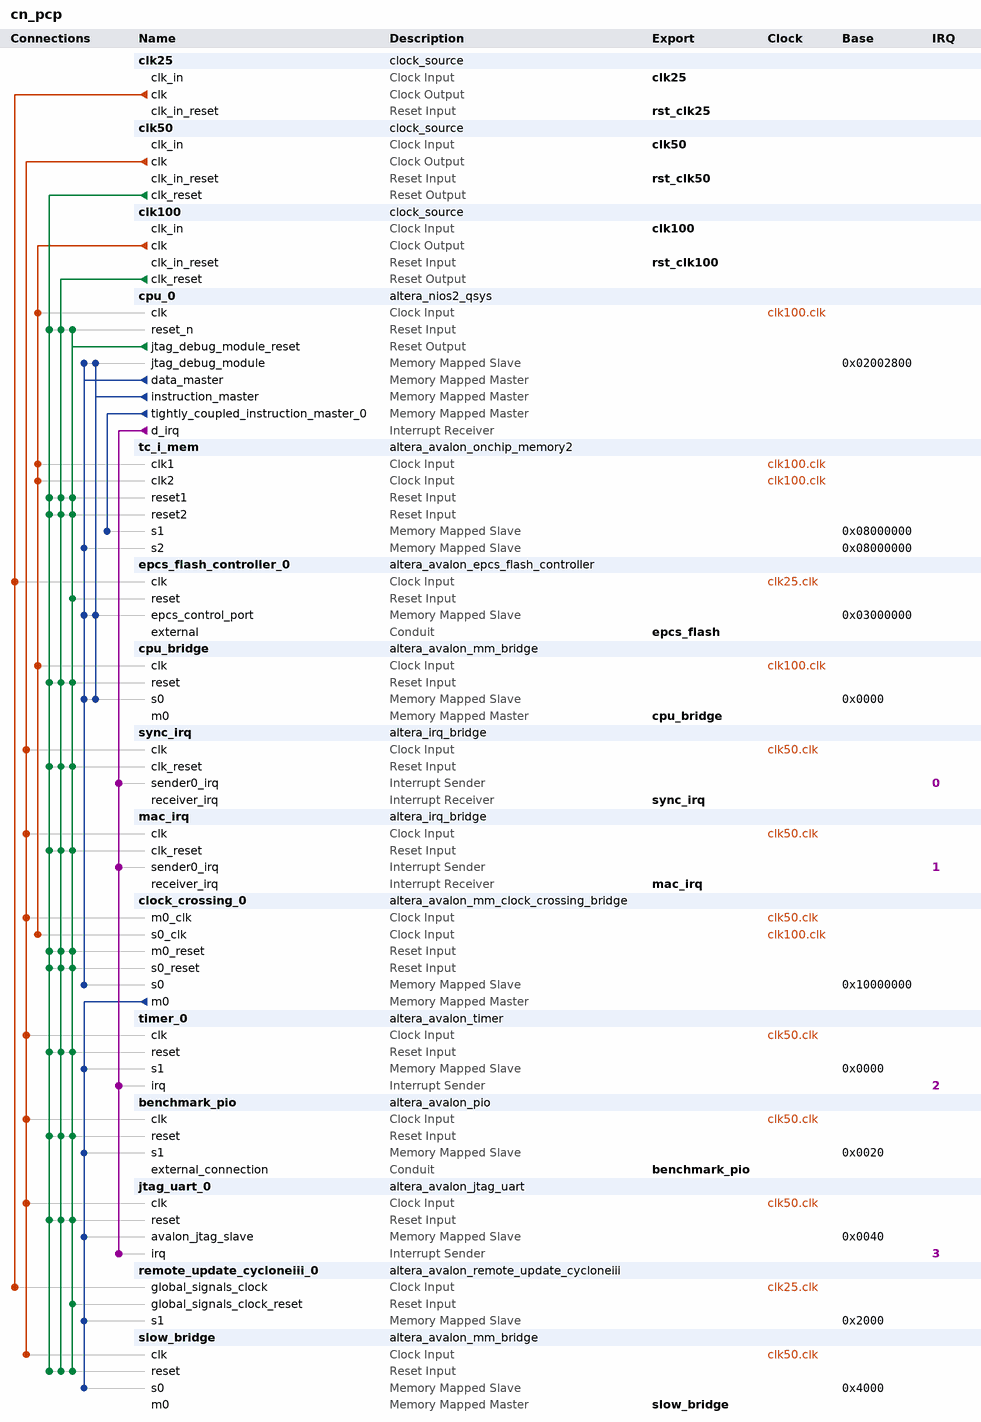
[diagram p0: system contents]
# Platform Designer (Qsys) system cn_pcp, Cyclone IV E EP4CE115F29C7
# Parameters at their usual value, and those the tool derives, are not listed.
package require -exact qsys 13.0
create_system cn_pcp
set_project_property DEVICE_FAMILY {Cyclone IV E}
set_project_property DEVICE EP4CE115F29C7

add_instance clk25 clock_source 13.0
set_instance_parameter_value clk25 clockFrequency 25000000

add_instance clk50 clock_source 13.0
set_instance_parameter_value clk50 clockFrequency 50000000

add_instance clk100 clock_source 13.0
set_instance_parameter_value clk100 clockFrequency 100000000

add_instance cpu_0 altera_nios2_qsys 13.0
set_instance_parameter_value cpu_0 exceptionOffset 0
set_instance_parameter_value cpu_0 cpuID 1
set_instance_parameter_value cpu_0 resetSlave epcs_flash_controller_0.epcs_control_port
set_instance_parameter_value cpu_0 exceptionSlave tc_i_mem.s1
set_instance_parameter_value cpu_0 breakSlave cpu_0.jtag_debug_module
set_instance_parameter_value cpu_0 impl Small
set_instance_parameter_value cpu_0 icache_size 2048
set_instance_parameter_value cpu_0 icache_numTCIM 1

add_instance tc_i_mem altera_avalon_onchip_memory2 13.0.1.99.2
set_instance_parameter_value tc_i_mem dataWidth 32
set_instance_parameter_value tc_i_mem dualPort true
set_instance_parameter_value tc_i_mem initMemContent true
set_instance_parameter_value tc_i_mem initializationFileName tc_i_mem
set_instance_parameter_value tc_i_mem memorySize 4096

add_instance epcs_flash_controller_0 altera_avalon_epcs_flash_controller 13.0.1.99.2

add_instance cpu_bridge altera_avalon_mm_bridge 13.0
set_instance_parameter_value cpu_bridge DATA_WIDTH 32
set_instance_parameter_value cpu_bridge ADDRESS_WIDTH 22
set_instance_parameter_value cpu_bridge ADDRESS_UNITS SYMBOLS
set_instance_parameter_value cpu_bridge MAX_PENDING_RESPONSES 1
set_instance_parameter_value cpu_bridge PIPELINE_COMMAND 0
set_instance_parameter_value cpu_bridge PIPELINE_RESPONSE 0

add_instance sync_irq altera_irq_bridge 13.0
set_instance_parameter_value sync_irq IRQ_WIDTH 1

add_instance mac_irq altera_irq_bridge 13.0
set_instance_parameter_value mac_irq IRQ_WIDTH 1

add_instance clock_crossing_0 altera_avalon_mm_clock_crossing_bridge 13.0
set_instance_parameter_value clock_crossing_0 DATA_WIDTH 32
set_instance_parameter_value clock_crossing_0 ADDRESS_WIDTH 16
set_instance_parameter_value clock_crossing_0 MAX_BURST_SIZE 1
set_instance_parameter_value clock_crossing_0 COMMAND_FIFO_DEPTH 4
set_instance_parameter_value clock_crossing_0 RESPONSE_FIFO_DEPTH 4
set_instance_parameter_value clock_crossing_0 MASTER_SYNC_DEPTH 2
set_instance_parameter_value clock_crossing_0 SLAVE_SYNC_DEPTH 2

add_instance timer_0 altera_avalon_timer 13.0.1.99.2
set_instance_parameter_value timer_0 alwaysRun true
set_instance_parameter_value timer_0 fixedPeriod true
set_instance_parameter_value timer_0 period 1
set_instance_parameter_value timer_0 periodUnits MSEC
set_instance_parameter_value timer_0 snapshot false

add_instance benchmark_pio altera_avalon_pio 13.0.1.99.2
set_instance_parameter_value benchmark_pio bitModifyingOutReg true
set_instance_parameter_value benchmark_pio direction Output
set_instance_parameter_value benchmark_pio width 8

add_instance jtag_uart_0 altera_avalon_jtag_uart 13.0.1.99.2
set_instance_parameter_value jtag_uart_0 simInteractiveOptions INTERACTIVE_ASCII_OUTPUT

add_instance remote_update_cycloneiii_0 altera_avalon_remote_update_cycloneiii 13.0
set_instance_parameter_value remote_update_cycloneiii_0 clockFrequency 25000000

add_instance slow_bridge altera_avalon_mm_bridge 13.0
set_instance_parameter_value slow_bridge DATA_WIDTH 32
set_instance_parameter_value slow_bridge ADDRESS_WIDTH 14
set_instance_parameter_value slow_bridge ADDRESS_UNITS SYMBOLS
set_instance_parameter_value slow_bridge MAX_PENDING_RESPONSES 1
set_instance_parameter_value slow_bridge PIPELINE_COMMAND 0
set_instance_parameter_value slow_bridge PIPELINE_RESPONSE 0

# connections
add_connection clk25.clk epcs_flash_controller_0.clk clock
add_connection clk25.clk remote_update_cycloneiii_0.global_signals_clock clock
add_connection clk50.clk benchmark_pio.clk clock
add_connection clk50.clk clock_crossing_0.m0_clk clock
add_connection clk50.clk jtag_uart_0.clk clock
add_connection clk50.clk mac_irq.clk clock
add_connection clk50.clk slow_bridge.clk clock
add_connection clk50.clk sync_irq.clk clock
add_connection clk50.clk timer_0.clk clock
add_connection clk100.clk clock_crossing_0.s0_clk clock
add_connection clk100.clk cpu_0.clk clock
add_connection clk100.clk cpu_bridge.clk clock
add_connection clk100.clk tc_i_mem.clk1 clock
add_connection clk100.clk tc_i_mem.clk2 clock
add_connection clk50.clk_reset benchmark_pio.reset reset
add_connection clk50.clk_reset clock_crossing_0.m0_reset reset
add_connection clk50.clk_reset clock_crossing_0.s0_reset reset
add_connection clk50.clk_reset cpu_0.reset_n reset
add_connection clk50.clk_reset cpu_bridge.reset reset
add_connection clk50.clk_reset jtag_uart_0.reset reset
add_connection clk50.clk_reset mac_irq.clk_reset reset
add_connection clk50.clk_reset slow_bridge.reset reset
add_connection clk50.clk_reset sync_irq.clk_reset reset
add_connection clk50.clk_reset tc_i_mem.reset1 reset
add_connection clk50.clk_reset tc_i_mem.reset2 reset
add_connection clk50.clk_reset timer_0.reset reset
add_connection clk100.clk_reset benchmark_pio.reset reset
add_connection clk100.clk_reset clock_crossing_0.m0_reset reset
add_connection clk100.clk_reset clock_crossing_0.s0_reset reset
add_connection clk100.clk_reset cpu_0.reset_n reset
add_connection clk100.clk_reset cpu_bridge.reset reset
add_connection clk100.clk_reset jtag_uart_0.reset reset
add_connection clk100.clk_reset mac_irq.clk_reset reset
add_connection clk100.clk_reset slow_bridge.reset reset
add_connection clk100.clk_reset sync_irq.clk_reset reset
add_connection clk100.clk_reset tc_i_mem.reset1 reset
add_connection clk100.clk_reset tc_i_mem.reset2 reset
add_connection clk100.clk_reset timer_0.reset reset
add_connection cpu_0.jtag_debug_module_reset benchmark_pio.reset reset
add_connection cpu_0.jtag_debug_module_reset clock_crossing_0.m0_reset reset
add_connection cpu_0.jtag_debug_module_reset clock_crossing_0.s0_reset reset
add_connection cpu_0.jtag_debug_module_reset cpu_0.reset_n reset
add_connection cpu_0.jtag_debug_module_reset cpu_bridge.reset reset
add_connection cpu_0.jtag_debug_module_reset epcs_flash_controller_0.reset reset
add_connection cpu_0.jtag_debug_module_reset jtag_uart_0.reset reset
add_connection cpu_0.jtag_debug_module_reset mac_irq.clk_reset reset
add_connection cpu_0.jtag_debug_module_reset remote_update_cycloneiii_0.global_signals_clock_reset reset
add_connection cpu_0.jtag_debug_module_reset slow_bridge.reset reset
add_connection cpu_0.jtag_debug_module_reset sync_irq.clk_reset reset
add_connection cpu_0.jtag_debug_module_reset tc_i_mem.reset1 reset
add_connection cpu_0.jtag_debug_module_reset tc_i_mem.reset2 reset
add_connection cpu_0.jtag_debug_module_reset timer_0.reset reset
add_connection clock_crossing_0.m0 benchmark_pio.s1 avalon
set_connection_parameter_value clock_crossing_0.m0/benchmark_pio.s1 baseAddress 0x0020
add_connection clock_crossing_0.m0 jtag_uart_0.avalon_jtag_slave avalon
set_connection_parameter_value clock_crossing_0.m0/jtag_uart_0.avalon_jtag_slave baseAddress 0x0040
add_connection clock_crossing_0.m0 remote_update_cycloneiii_0.s1 avalon
set_connection_parameter_value clock_crossing_0.m0/remote_update_cycloneiii_0.s1 baseAddress 0x2000
add_connection clock_crossing_0.m0 slow_bridge.s0 avalon
set_connection_parameter_value clock_crossing_0.m0/slow_bridge.s0 baseAddress 0x4000
add_connection clock_crossing_0.m0 timer_0.s1 avalon
set_connection_parameter_value clock_crossing_0.m0/timer_0.s1 baseAddress 0x0000
add_connection cpu_0.data_master clock_crossing_0.s0 avalon
set_connection_parameter_value cpu_0.data_master/clock_crossing_0.s0 baseAddress 0x10000000
add_connection cpu_0.data_master cpu_0.jtag_debug_module avalon
set_connection_parameter_value cpu_0.data_master/cpu_0.jtag_debug_module baseAddress 0x02002800
add_connection cpu_0.data_master cpu_bridge.s0 avalon
set_connection_parameter_value cpu_0.data_master/cpu_bridge.s0 baseAddress 0x0000
add_connection cpu_0.data_master epcs_flash_controller_0.epcs_control_port avalon
set_connection_parameter_value cpu_0.data_master/epcs_flash_controller_0.epcs_control_port baseAddress 0x03000000
add_connection cpu_0.data_master tc_i_mem.s2 avalon
set_connection_parameter_value cpu_0.data_master/tc_i_mem.s2 baseAddress 0x08000000
add_connection cpu_0.instruction_master cpu_0.jtag_debug_module avalon
set_connection_parameter_value cpu_0.instruction_master/cpu_0.jtag_debug_module baseAddress 0x02002800
add_connection cpu_0.instruction_master cpu_bridge.s0 avalon
set_connection_parameter_value cpu_0.instruction_master/cpu_bridge.s0 baseAddress 0x0000
add_connection cpu_0.instruction_master epcs_flash_controller_0.epcs_control_port avalon
set_connection_parameter_value cpu_0.instruction_master/epcs_flash_controller_0.epcs_control_port baseAddress 0x03000000
add_connection cpu_0.tightly_coupled_instruction_master_0 tc_i_mem.s1 avalon
set_connection_parameter_value cpu_0.tightly_coupled_instruction_master_0/tc_i_mem.s1 baseAddress 0x08000000
add_connection cpu_0.d_irq jtag_uart_0.irq interrupt
set_connection_parameter_value cpu_0.d_irq/jtag_uart_0.irq irqNumber 3
add_connection cpu_0.d_irq mac_irq.sender0_irq interrupt
set_connection_parameter_value cpu_0.d_irq/mac_irq.sender0_irq irqNumber 1
add_connection cpu_0.d_irq sync_irq.sender0_irq interrupt
set_connection_parameter_value cpu_0.d_irq/sync_irq.sender0_irq irqNumber 0
add_connection cpu_0.d_irq timer_0.irq interrupt
set_connection_parameter_value cpu_0.d_irq/timer_0.irq irqNumber 2

# exported interfaces
add_interface clk50 clock sink
set_interface_property clk50 EXPORT_OF clk50.clk_in
add_interface rst_clk50 reset sink
set_interface_property rst_clk50 EXPORT_OF clk50.clk_in_reset
add_interface clk100 clock sink
set_interface_property clk100 EXPORT_OF clk100.clk_in
add_interface rst_clk100 reset sink
set_interface_property rst_clk100 EXPORT_OF clk100.clk_in_reset
add_interface benchmark_pio conduit end
set_interface_property benchmark_pio EXPORT_OF benchmark_pio.external_connection
add_interface cpu_bridge avalon master
set_interface_property cpu_bridge EXPORT_OF cpu_bridge.m0
add_interface slow_bridge avalon master
set_interface_property slow_bridge EXPORT_OF slow_bridge.m0
add_interface mac_irq interrupt receiver
set_interface_property mac_irq EXPORT_OF mac_irq.receiver_irq
add_interface sync_irq interrupt receiver
set_interface_property sync_irq EXPORT_OF sync_irq.receiver_irq
add_interface epcs_flash conduit end
set_interface_property epcs_flash EXPORT_OF epcs_flash_controller_0.external
add_interface clk25 clock sink
set_interface_property clk25 EXPORT_OF clk25.clk_in
add_interface rst_clk25 reset sink
set_interface_property rst_clk25 EXPORT_OF clk25.clk_in_reset

set_interconnect_requirement {$system} qsys_mm.clockCrossingAdapter HANDSHAKE
set_interconnect_requirement {$system} qsys_mm.maxAdditionalLatency 0

save_system cn_pcp.qsys
